# EAGLE design Screen Board (EAGLE 8.2.2)
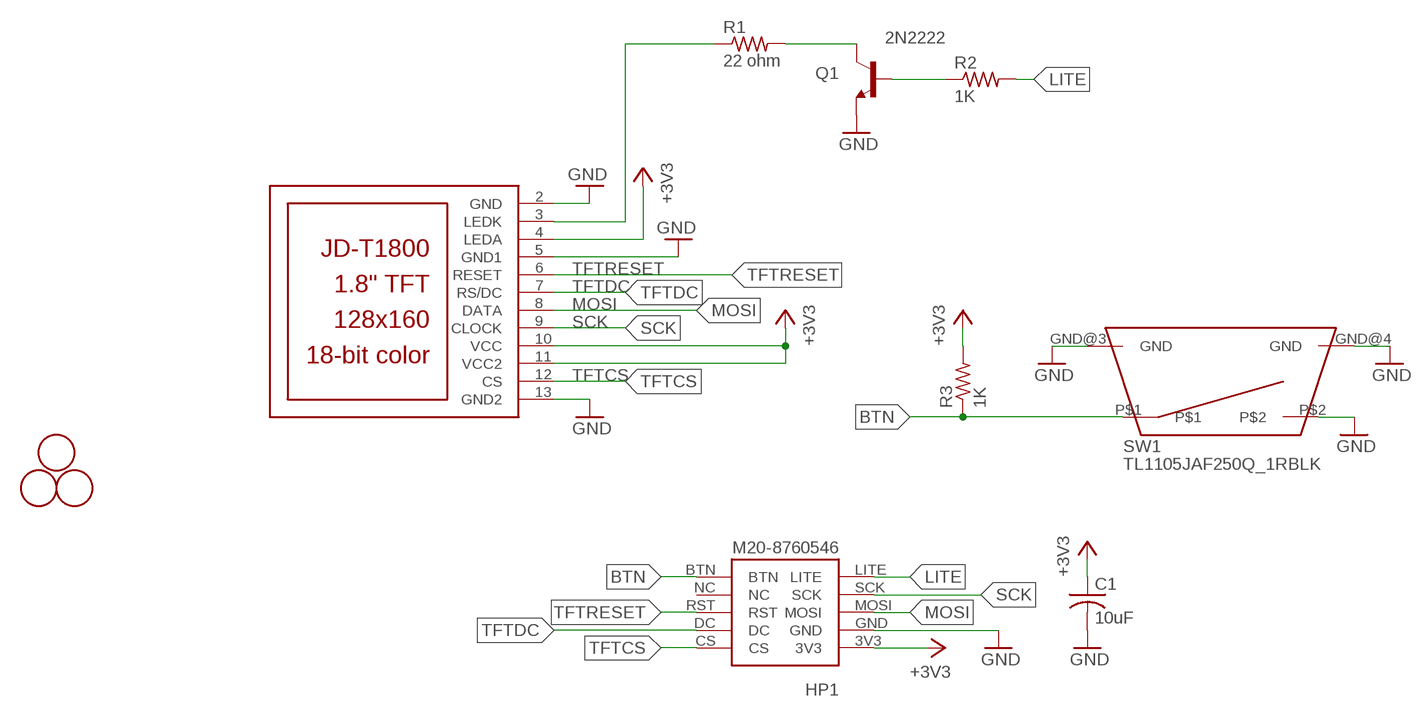
[diagram p0: schematic, sheet 1]

## Parts
C1  10uF  C-USC0805K  [C0805K]
HP1  M20-8760546  [M20-8760546]
Q1  2N2222  MMBT2222ALT1-NPN-SOT23-BEC  [SOT23-BEC]
R1  22 ohm  R-US_R0805  [R0805]
R2  1K  R-US_R0805  [R0805]
R3  1K  R-US_R0805  [R0805]
SW1  TL1105JAF250Q_1RBLK  [TL1105JAF250Q_1RBLK]
U$1  JD-T1800  [JD-T1800]
U$3  FIDUCIAL  [FIDUCIAL_1MM]
U$4  FIDUCIAL  [FIDUCIAL_1MM]
U$5  FIDUCIAL  [FIDUCIAL_1MM]

## Nets
+3V3 [power]: C1.1 HP1.3V3 R3.2 U$1.4(LEDA) U$1.10(VCC) U$1.11(VCC2)
BTN: HP1.BTN R3.1 SW1.P$1
GND: C1.2 HP1.GND Q1.E SW1.GND@3(GND) SW1.GND@4(GND) SW1.P$2 U$1.2(GND) U$1.5(GND1) U$1.13(GND2)
LITE: HP1.LITE R2.2
MOSI: HP1.MOSI U$1.8(DATA)
N$1: Q1.B R2.1
N$4: R1.1 U$1.3(LEDK)
N$5: Q1.C R1.2
SCK: HP1.SCK U$1.9(CLOCK)
TFTCS: HP1.CS U$1.12(CS)
TFTDC: HP1.DC U$1.7(RS/DC)
TFTRESET: HP1.RST U$1.6(RESET)
Unconnected: HP1.NC

## Library data of the parts
C1 = rcl:C-US: CAPACITOR, American symbol
HP1 = M20-8760546:M20-8760546; MALE_HEADER: 2X5
Q1 = transistor:*-NPN-: NPN Transistror BF959 corrected 2008.03.06
R1-R3 = adafruit:R-US_: RESISTOR, American symbol
SW1 = TL1105JAF250Q_1RBLK:TL1105JAF250Q_1RBLK; PUSH_BUTTON_WITH_CAP: TL1105JAF250Q_1RBLK
U$1 = adafruit:JD-T1800
U$3-U$5 = adafruit:FIDUCIAL: For use by pick and place machines to calibrate the vision/machine, 1mm By microbuilder.eu

## Net classes
1 power: width 0.406 mm

## Board
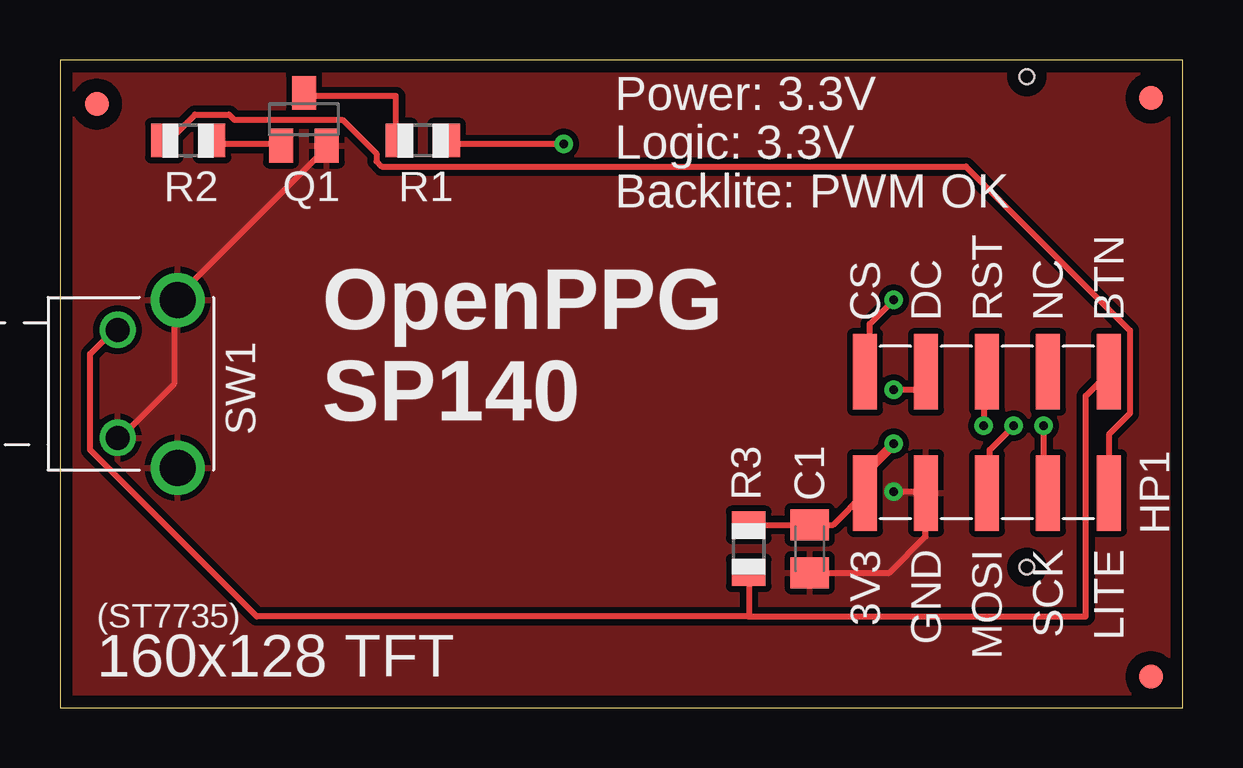
[diagram p1: board, top side]
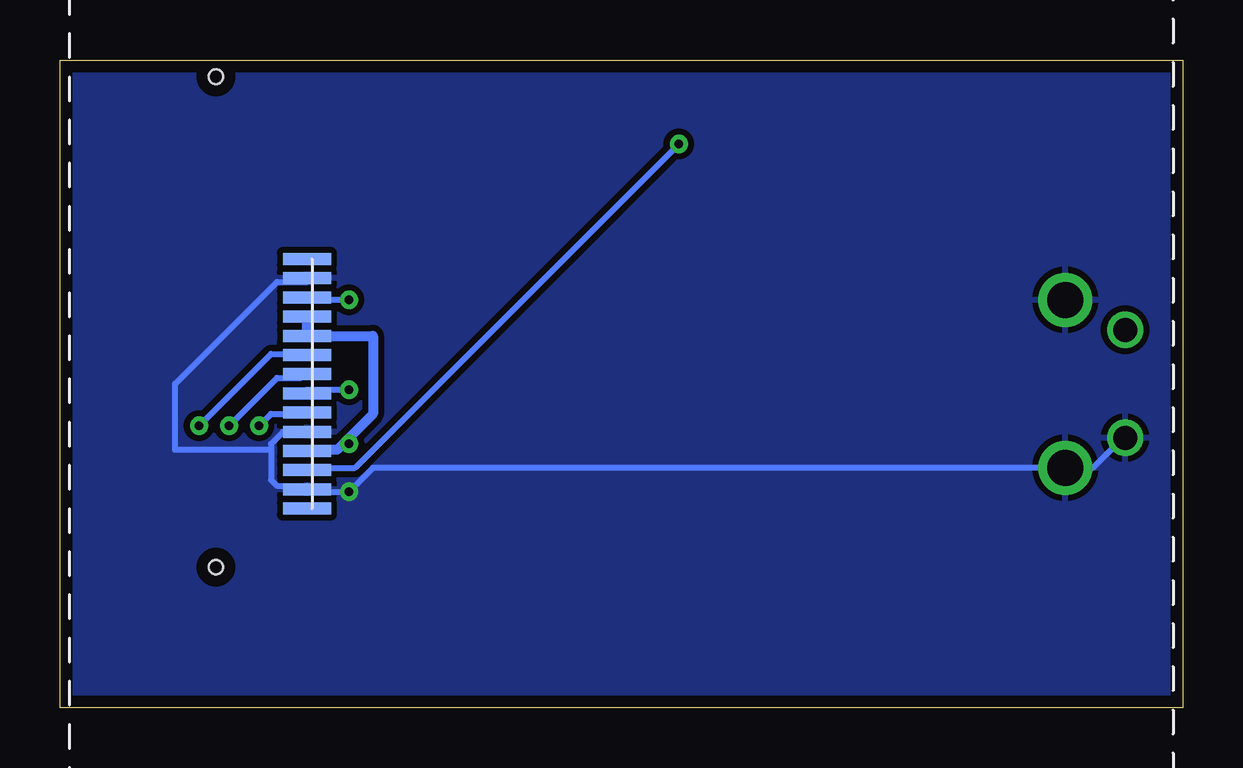
[diagram p2: board, bottom side, seen from below]

Size 46.8 x 27 mm. Coordinates in mm from the lower left corner, seen from the top.
Outline: 0,27 0,0 46.8,0 46.8,27 0,27
Copper layers (1*16): Top 0.035mm / dielectric 1.5mm / Bottom 0.035mm
Design rules "default *": minimum track width 10mil, minimum drill 14mil, track to track 10mil, track to pad 10mil, pad to pad 10mil, via to via 10mil, smd to smd 8mil, copper to edge 20mil, drill to drill 8mil, minimum pad ring 10mil, minimum via ring 8mil, stop-mask expansion 4mil, vias tented up to drill 20mil, thermal gap 10mil

### Footprints (pad centres in the part's own frame; a part is rotated, then mirrored left to right if it is on the bottom)
C0805K = smd 1.3 x 1.6: 1 -1,0; 2 1,0
M20-8760546 = smd 1 x 3.15: 3V3 0,1.075; BTN 10.16,6.125; CS 0,6.125; DC 2.54,6.125; GND 2.54,1.075; LITE 10.16,1.075; MOSI 5.08,1.075; NC 7.62,6.125; RST 5.08,6.125; SCK 7.62,1.075
SOT23-BEC = smd 1 x 1.4: B -0.95,-1.1; C 0,1.1; E 0.95,-1.1
R0805 = smd 1.1 x 1.4: 1 -1,0; 2 1,0
TL1105JAF250Q_1RBLK = drill 1.5: GND@3 -3.5,5.4; GND@4 3.5,5.4 | drill 1: P$1 -2.25,2.9; P$2 2.25,2.9
JD-T1800 = smd 0.5 x 2: 1 5.2,-13.1; 2 4.4,-13.1; 3 3.6,-13.1; 4 2.8,-13.1; 5 2,-13.1; 6 1.2,-13.1; 7 0.4,-13.1; 8 -0.4,-13.1; 9 -1.2,-13.1; 10 -2,-13.1; 11 -2.8,-13.1; 12 -3.6,-13.1; 13 -4.4,-13.1; 14 -5.2,-13.1 | hole 0.6: -12.8,-16.9; 7.65,-16.9
FIDUCIAL_1MM = smd 1 x 1: 1 0,0

### Placement (x,y rotation side)
C1  31.25,6.62 270 top
HP1  33.56,7.87 0 top
Q1  10.17,24.53 0 top
R1  15.12,23.64 180 top
R2  5.34,23.64 180 top
R3  28.71,6.62 90 top
SW1  -0.5,13.5 270 top
U$1  23.4,13.5 270 bottom
U$3  45.47,1.29 0 top
U$4  45.47,25.42 90 top
U$5  1.53,25.16 0 top

### Tracks (layer width: path | path; a pad name or v marks a point on that pad's centre or on a via)
+3V3  (via drill 0.36)
  Top 0.254: R3.2 C1.1 32.23,7.62 HP1.3V3
  Top 0.406: v34.75,11 33.75,10 33.75,9 HP1.3V3
  Bottom 0.406: 34.88,11.12 33.75,12.25 33.75,15.5 U$1.10 U$1.11 | 34.88,11.12 35.25,10.75 36.5,10.75 U$1.4 | v34.75,11 34.88,11.12
BTN
  Top 0.254: SW1.P$1 2.25,15.75 1.25,14.75 1.25,10.75 8.2,3.8 28.7,3.8 | HP1.BTN 43.5,13.75 42.75,13 42.75,3.8 28.7,3.8 | R3.1 28.71,3.81 28.7,3.8
GND  (via drill 0.36)
  Top 0.254: v34.75,9 36,9 HP1.GND 36.08,8.92 36.08,7.13 34.57,5.62 C1.2 | Q1.E 11,23.25 5,17.25 5,17 SW1.GND@3 4.75,17 4.75,13.5 2.5,11.25 SW1.P$2
  Bottom 0.254: 38,10.75 38,11 37.5,11.5 U$1.5 | 38,10.75 38,9.5 37.75,9.25 36.5,9.25 U$1.2 36.5,9 v34.75,9 33.75,10 SW1.GND@4 3.75,10 2.5,11.25 SW1.P$2 | 38,10.75 42,10.75 42,13.5 37.75,17.75 36.5,17.75 U$1.13
  pour Bottom: 0.01,26.94 0.01,0.02 46.74,0.02 46.74,26.94
  pour Top: 0.01,0.02 46.74,0.02 46.74,26.94 0.01,26.94
LITE
  Top 0.254: R2.2 4.55,23.64 5.63,24.72 7.05,24.72 7.26,24.51 11.78,24.51 13.19,23.09 13.19,22.78 13.41,22.56 37.77,22.56 44.6,15.73 44.6,12.26 43.72,11.38 HP1.LITE
MOSI  (via drill 0.36)
  Top 0.254: v39.75,11.75 38.75,10.75 38.75,9 HP1.MOSI
  Bottom 0.254: v39.75,11.75 37.75,13.75 36.75,13.75 36.5,14 U$1.8
N$1
  Top 0.254: R2.1 6.5,23.5 9,23.5 Q1.B
N$4  (via drill 0.36)
  Top 0.254: v21,23.5 16.25,23.5 R1.1
  Bottom 0.254: v21,23.5 34.5,10 36.5,10 U$1.3
N$5
  Top 0.254: Q1.C 10.25,25.5 14,25.5 14,23.75 R1.2
SCK  (via drill 0.36)
  Top 0.254: v41,11.75 41,9 HP1.SCK
  Bottom 0.254: v41,11.75 38,14.75 36.5,14.75 U$1.9
TFTCS  (via drill 0.36)
  Top 0.254: v34.75,17 33.75,16 33.75,14 HP1.CS
  Bottom 0.254: v34.75,17 36.5,17 U$1.12
TFTDC  (via drill 0.36)
  Top 0.254: v34.75,13.25 36,13.25 36,13.75 HP1.DC
  Bottom 0.254: v34.75,13.25 36.5,13.25 U$1.7
TFTRESET  (via drill 0.36)
  Top 0.254: v38.5,11.75 38.5,13.75 HP1.RST
  Bottom 0.254: v38.5,11.75 38,12.25 36.5,12.25 U$1.6

### Text on the board
tPlace: Power: 3.3V | Logic: 3.3V | Backlite: PWM OK | OpenPPG / SP140 | (ST7735) | 160x128 TFT